# EAGLE design sauroneye (EAGLE 6.2)
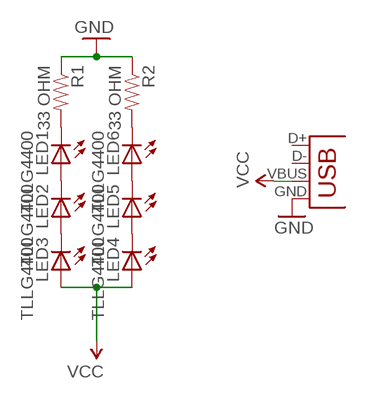
[diagram p0: schematic, sheet 1]

## Parts
LED1  TLLG4400  [LED3MM]
LED2  TLLG4400  [LED3MM]
LED3  TLLG4400  [LED3MM]
LED4  TLLG4400  [LED3MM]
LED5  TLLG4400  [LED3MM]
LED6  TLLG4400  [LED3MM]
R1  33 OHM  RESISTORAXIAL-0.3  [AXIAL-0.3]
R2  33 OHM  RESISTORAXIAL-0.3  [AXIAL-0.3]
X1  USBSMD  [USB-MINIB]

## Nets
GND: R1.P$1 R2.P$1 X1.GND
N$1: LED6.K(C) R2.P$2
N$2: LED1.K(C) R1.P$2
N$3: LED5.K(C) LED6.A
N$4: LED4.K(C) LED5.A
N$5: LED1.A LED2.K(C)
N$6: LED2.A LED3.K(C)
VCC: LED3.A LED4.A X1.VBUS
Unconnected: X1.D+ X1.D-

## Library data of the parts
LED1-LED6 = led:TLLG4400: Low Current (2mA) LED 3 mm Tinted Diffused Package color GREEN Source: Data sheet <http://www.farnell.com/datasheets/391098.pdf>; MF: VISHAY SEMICONDUCTOR; OC_FARNELL: 1612435
R1 R2 = SparkFun:RESISTOR: Resistor Basic schematic elements and footprints for 0603, 1206, and PTH resistors.
X1 = SparkFun:USB: USB Connectors USB-B-PTH is fully proven SKU : PRT-00139 USB-miniB is fully proven SKU : PRT-00587 USB-A-PCB is untested. USB-A-H is throughly reviewed, but untested. Spark Fun Electronics SKU : PRT-00437 USB-B-SMT is throughly reviewed, but untested. Needs silkscreen touching up. USB-A-S has not been used/tested USB-MB-H has not been used/tested

## Board
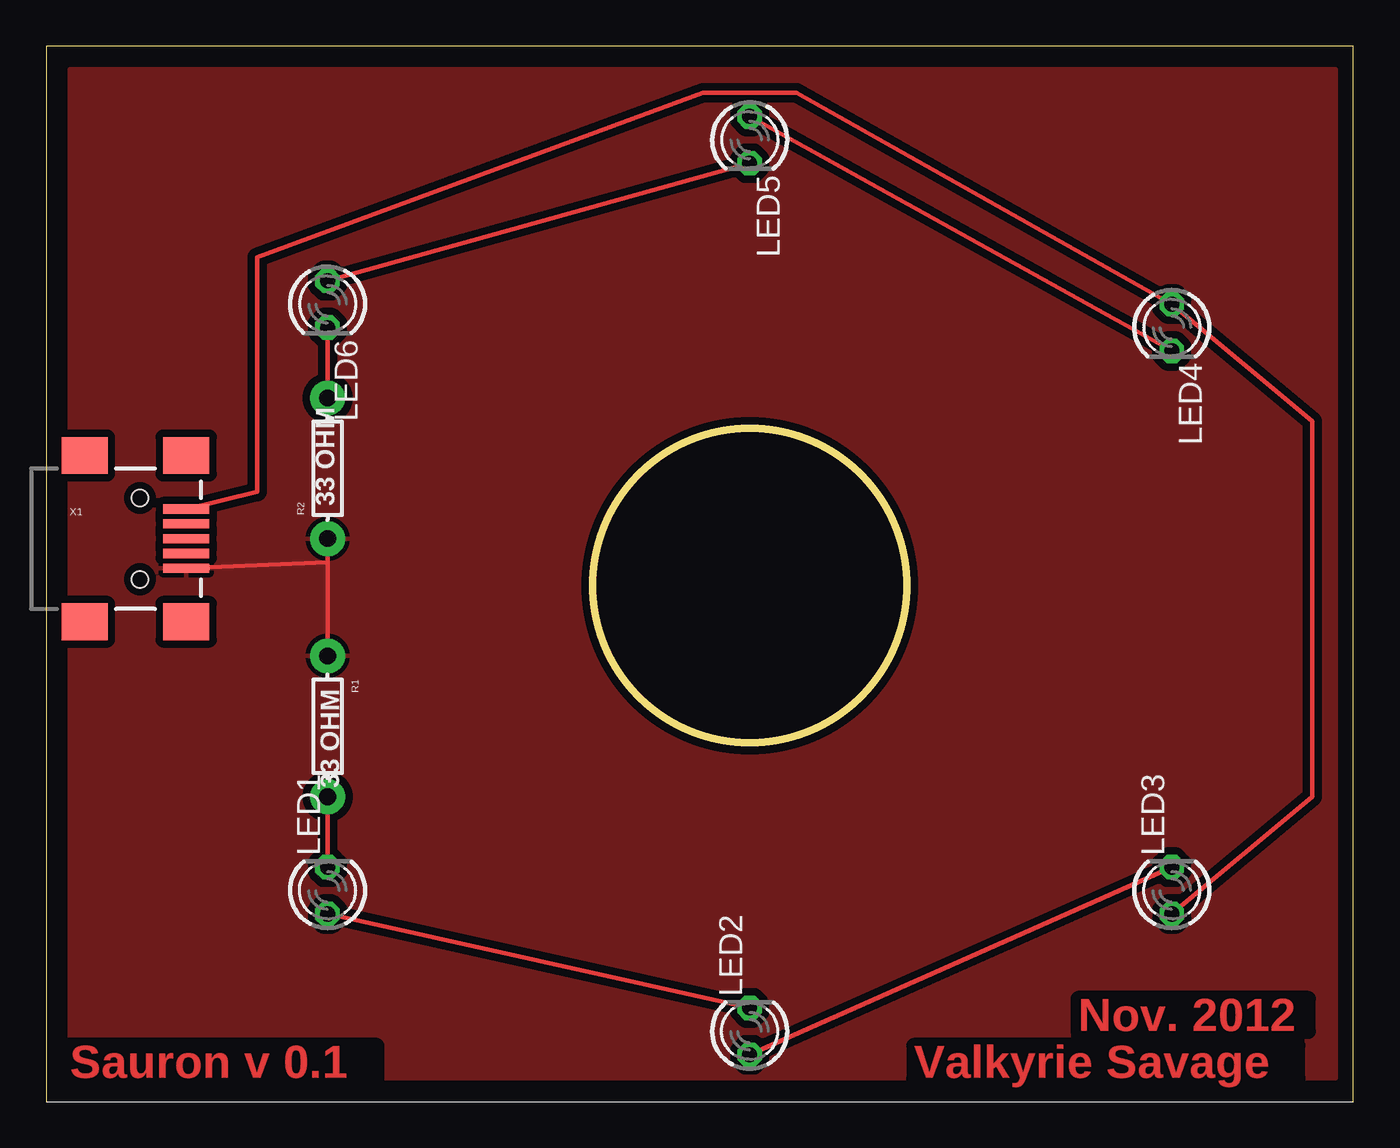
[diagram p1: board, top side]

Size 70.79 x 57.14 mm. Coordinates in mm from the lower left corner, seen from the top.
Outline: 70.79,0 70.79,57.14 0,57.14 0,0
Outline: circle at 38.1,27.94 radius 8.51
Copper layers (1*16): Top 0.035559375mm / dielectric 1.501140625mm / Bottom 0.035559375mm
Design rules "default": minimum track width 4mil, minimum drill 0.39878125mm, track to track 4mil, track to pad 4mil, pad to pad 4mil, via to via 8mil, smd to smd 4mil, copper to edge 8mil, drill to drill 8mil, minimum pad ring 10mil, minimum via ring 8mil, stop-mask expansion 4mil, vias tented up to drill 0mil, thermal gap 10mil

### Footprints (pad centres in the part's own frame; a part is rotated, then mirrored left to right if it is on the bottom)
LED3MM = drill 0.813 octagon: A -1.27,0; K 1.27,0
AXIAL-0.3 = drill 0.9 pad 1.88: P$1 -3.81,0; P$2 3.81,0
USB-MINIB = smd 2.5 x 0.5: D+ 2.5,0; D- 2.5,0.8; GND 2.5,-1.6; ID 2.5,-0.8; VBUS 2.5,1.6 | smd 2.5 x 2: MTN1 -3,4.5; MTN2 2.5,4.5; MTN3 -3,-4.5; MTN4 2.5,-4.5 | hole 0.9: 0,2.2; 0,-2.2

### Placement (x,y rotation side)
LED1  15.24,11.43 90 top
LED2  38.1,3.81 90 top
LED3  60.96,11.43 90 top
LED4  60.96,41.91 270 top
LED5  38.1,52.07 270 top
LED6  15.24,43.18 270 top
R1  15.24,20.32 270 top
R2  15.24,34.29 90 top
X1  5.08,30.48 0 top

### Tracks (layer width: path | path; a pad name or v marks a point on that pad's centre or on a via)
GND
  Top 0.254: R2.P$1 15.24,29.21 | 15.24,29.21 R1.P$1 | X1.GND 15.24,29.21
  pour Top (isolate 0.406): 1.27,55.88 69.85,55.88 69.85,1.27 1.27,1.27
N$1
  Top 0.254: LED6.K R2.P$2
N$2
  Top 0.254: R1.P$2 LED1.K
N$3
  Top 0.254: LED5.K LED6.A
N$4
  Top 0.254: LED4.K LED5.A
N$5
  Top 0.254: LED1.A LED2.K
N$6
  Top 0.254: LED2.A LED3.K
VCC
  Top 0.254: LED3.A 68.58,16.51 68.58,36.83 LED4.A 40.64,54.61 35.56,54.61 11.43,45.72 11.43,33.02 X1.VBUS

### Text on the board
Top: Nov. 2012 | Sauron v 0.1 | Valkyrie Savage